# EAGLE design Nano_C1101 (EAGLE 9.5.2)
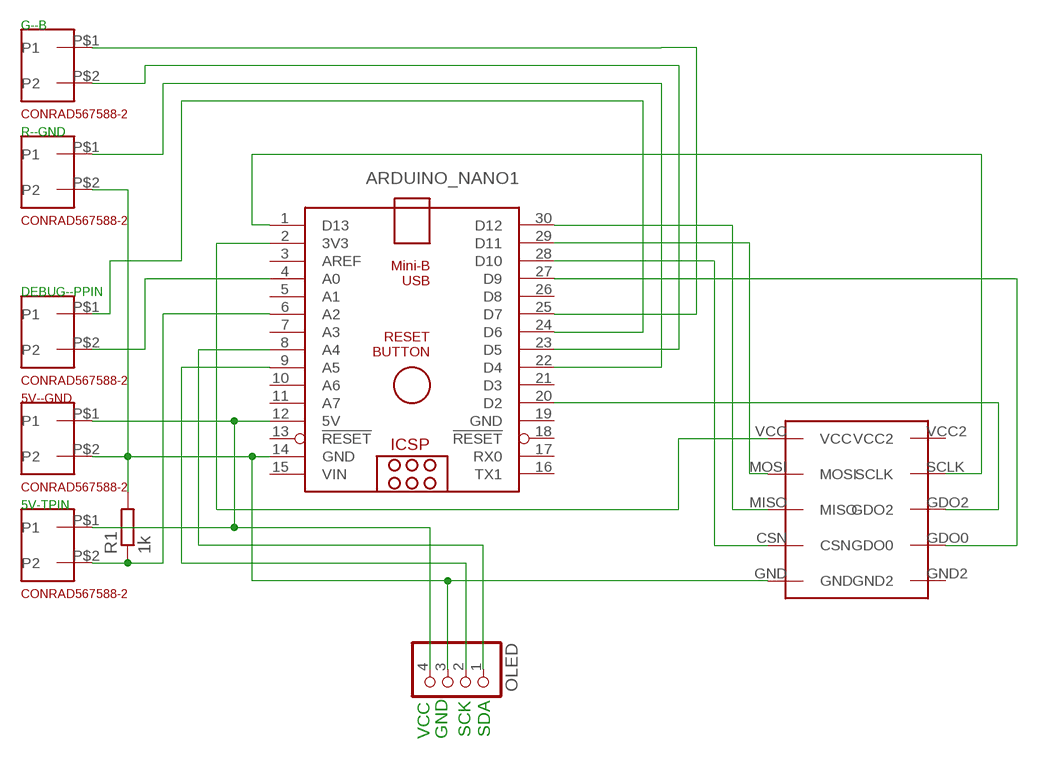
[diagram p0: schematic, sheet 1]

## Parts
5V--GND  CONRAD567588-2  [CONRAD567588]
5V-TPIN  CONRAD567588-2  [CONRAD567588]
ARDUINO_NANO1  ARDUINO_NANO  [ARDUINO_NANO]
DEBUG--PPIN  CONRAD567588-2  [CONRAD567588]
G--B  CONRAD567588-2  [CONRAD567588]
OLED  PINHD-1X4  [1X04]
R1  1k  R-EU_0204/7  [0204/7]
R--GND  CONRAD567588-2  [CONRAD567588]
U$1  NEUFTECH_CC1101  [NEUFTECH_CC1101_PACKAGE]

## Nets
3V3: ARDUINO_NANO1.2(3V3) U$1.VCC
5V: 5V--GND.P$1(P1) 5V-TPIN.P$1(P1) ARDUINO_NANO1.12(5V) OLED.4
B-RGB: ARDUINO_NANO1.23(D5) G--B.P$2(P2)
CSN: ARDUINO_NANO1.28(D10) U$1.CSN
DEBUG: ARDUINO_NANO1.24(D6) DEBUG--PPIN.P$1(P1)
G-RGB: ARDUINO_NANO1.25(D7) G--B.P$1(P1)
GDO0: ARDUINO_NANO1.27(D9) U$1.GDO0
GDO2: ARDUINO_NANO1.20(D2) U$1.GDO2
GND: 5V--GND.P$2(P2) ARDUINO_NANO1.14(GND) OLED.3 R1.2 R--GND.P$2(P2) U$1.GND
MISO: ARDUINO_NANO1.30(D12) U$1.MISO
MOSI: ARDUINO_NANO1.29(D11) U$1.MOSI
PPIN: ARDUINO_NANO1.4(A0) DEBUG--PPIN.P$2(P2)
R-RGB: ARDUINO_NANO1.22(D4) R--GND.P$1(P1)
SCK: ARDUINO_NANO1.9(A5) OLED.2
SCLK: ARDUINO_NANO1.1(D13) U$1.SCLK
SDA: ARDUINO_NANO1.8(A4) OLED.1
TPIN: 5V-TPIN.P$2(P2) ARDUINO_NANO1.6(A2) R1.1
Unconnected: ARDUINO_NANO1.3(AREF) ARDUINO_NANO1.5(A1) ARDUINO_NANO1.7(A3) ARDUINO_NANO1.10(A6) ARDUINO_NANO1.11(A7) ARDUINO_NANO1.13(!RESET) ARDUINO_NANO1.16(TX1) ARDUINO_NANO1.17(RX0) ARDUINO_NANO1.18(!RESET) ARDUINO_NANO1.21(D3) ARDUINO_NANO1.26(D8) U$1.GND2 U$1.VCC2

## Notes on the sheet
- VCC | GND | SCK | SDA

## Power pins joined to a net without a drawn wire
GND: ARDUINO_NANO1.19(GND)
VIN: ARDUINO_NANO1.15(VIN)

## Library data of the parts
5V--GND 5V-TPIN DEBUG--PPIN G--B R--GND = johannes:CONRAD567588-2
ARDUINO_NANO1 = ArduinoNanoV30:ARDUINO_NANO: Arduino Nano V3.0 Overview: The Arduino Nano is a small, complete, and breadboard-friendly board based on the ATmega328 (Arduino Nano 3.x) or ATmega168 (Arduino Nano 2.x). It has more or less the same functionality of the Arduino Duemilanove, but in a different package. It lacks only a DC power jack, and works with a Mini-B USB cable instead of a standard one. The Nano was designed and is being produced by Gravitech. Specifications: Microcontroller Atmel ATmega168 or ATmega328 Operating Voltage (logic level) 5 V Input Voltage (recommended) 7-12 V Input Voltage (limits) 6-20 V Digital I/O Pins 14 (of which 6 provide PWM output) Analog Input Pins 8 DC Current per I/O Pin 40 mA Flash Memory 16 KB (ATmega168) or 32 KB (ATmega328) of which 2 KB used by bootloader SRAM 1 KB (ATmega168) or 2 KB (ATmega328) EEPROM 512 bytes (ATmega168) or 1 KB (ATmega328) Clock Speed 16 MHz Dimensions 0.73" x 1.70" Length 45 mm Width 18 mm Weigth 5 g Power: The Arduino Nano can be powered via the Mini-B USB connection, 6-20V unregulated external power supply (pin 30), or 5V regulated external power supply (pin 27). The power source is automatically selected to the highest voltage source. Memory: The ATmega168 has 16 KB of flash memory for storing code (of which 2 KB is used for the bootloader); the ATmega328 has 32 KB, (also with 2 KB used for the bootloader). The ATmega168 has 1 KB of SRAM and 512 bytes of EEPROM (which can be read and written with the EEPROM library); the ATmega328 has 2 KB of SRAM and 1 KB of EEPROM. Input and Output: Each of the 14 digital pins on the Nano can be used as an input or output, using pinMode(), digitalWrite(), and digitalRead() functions. They operate at 5 volts. Each pin can provide or receive a maximum of 40 mA and has an internal pull-up resistor (disconnected by default) of 20-50 kOhms. In addition, some pins have specialized functions. Visit Arduino - ArduinoBoardNano <https://www.arduino.cc/en/Main/ArduinoBoardNano>
OLED = pinhead:PINHD-1X4: PIN HEADER
R1 = rcl:R-EU_: RESISTOR, European symbol; SPICEPREFIX: R
U$1 = johannes:NEUFTECH_CC1101

## Board
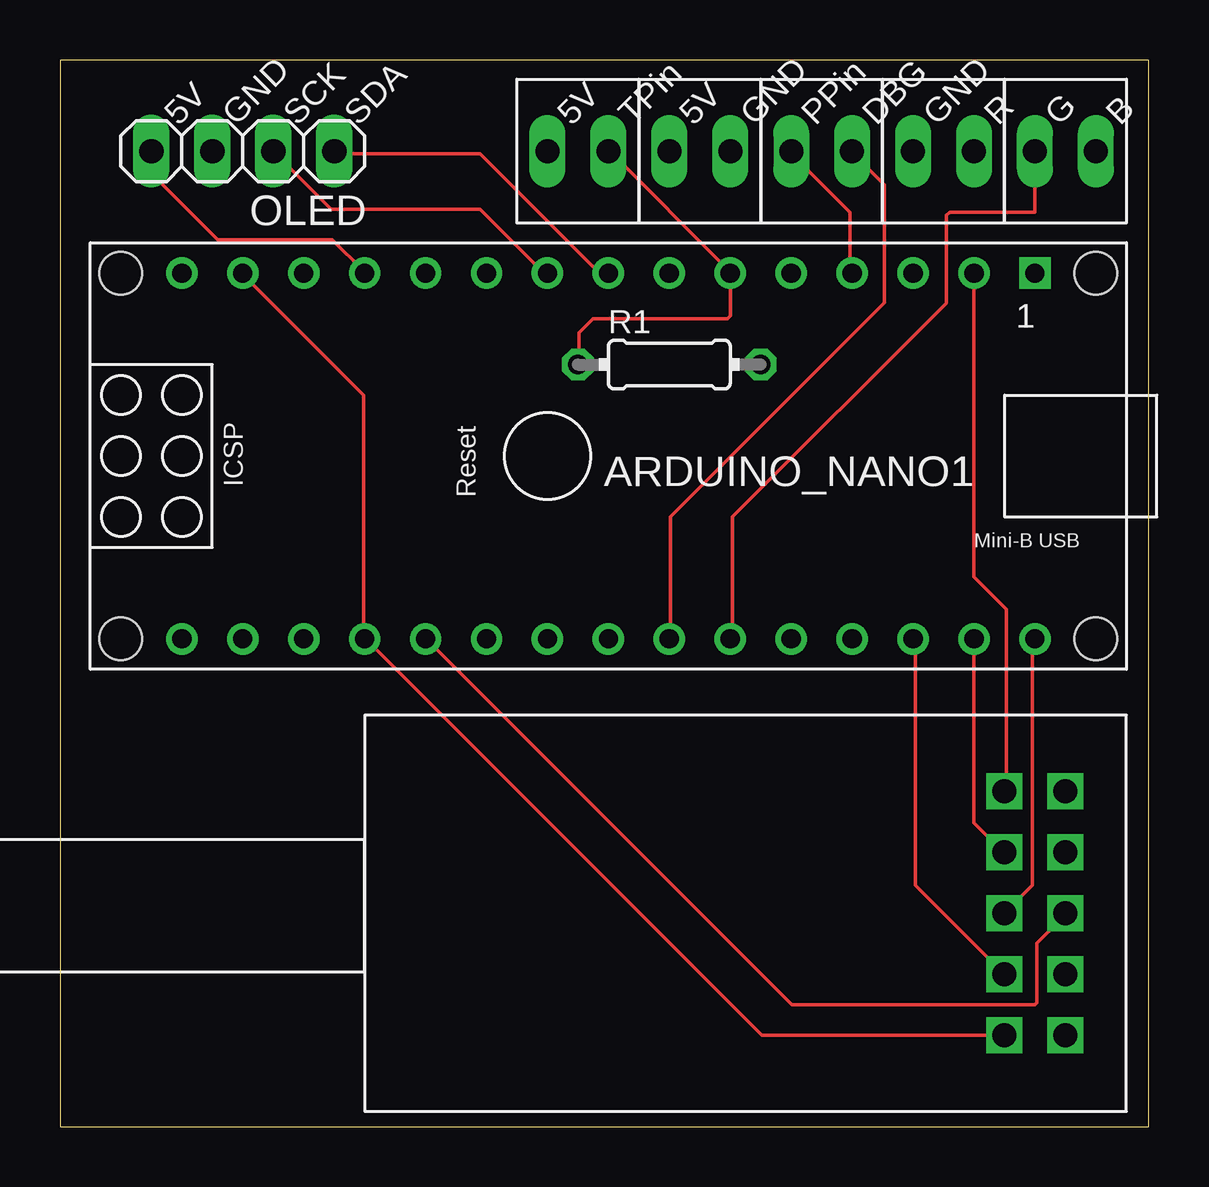
[diagram p1: board, top side]
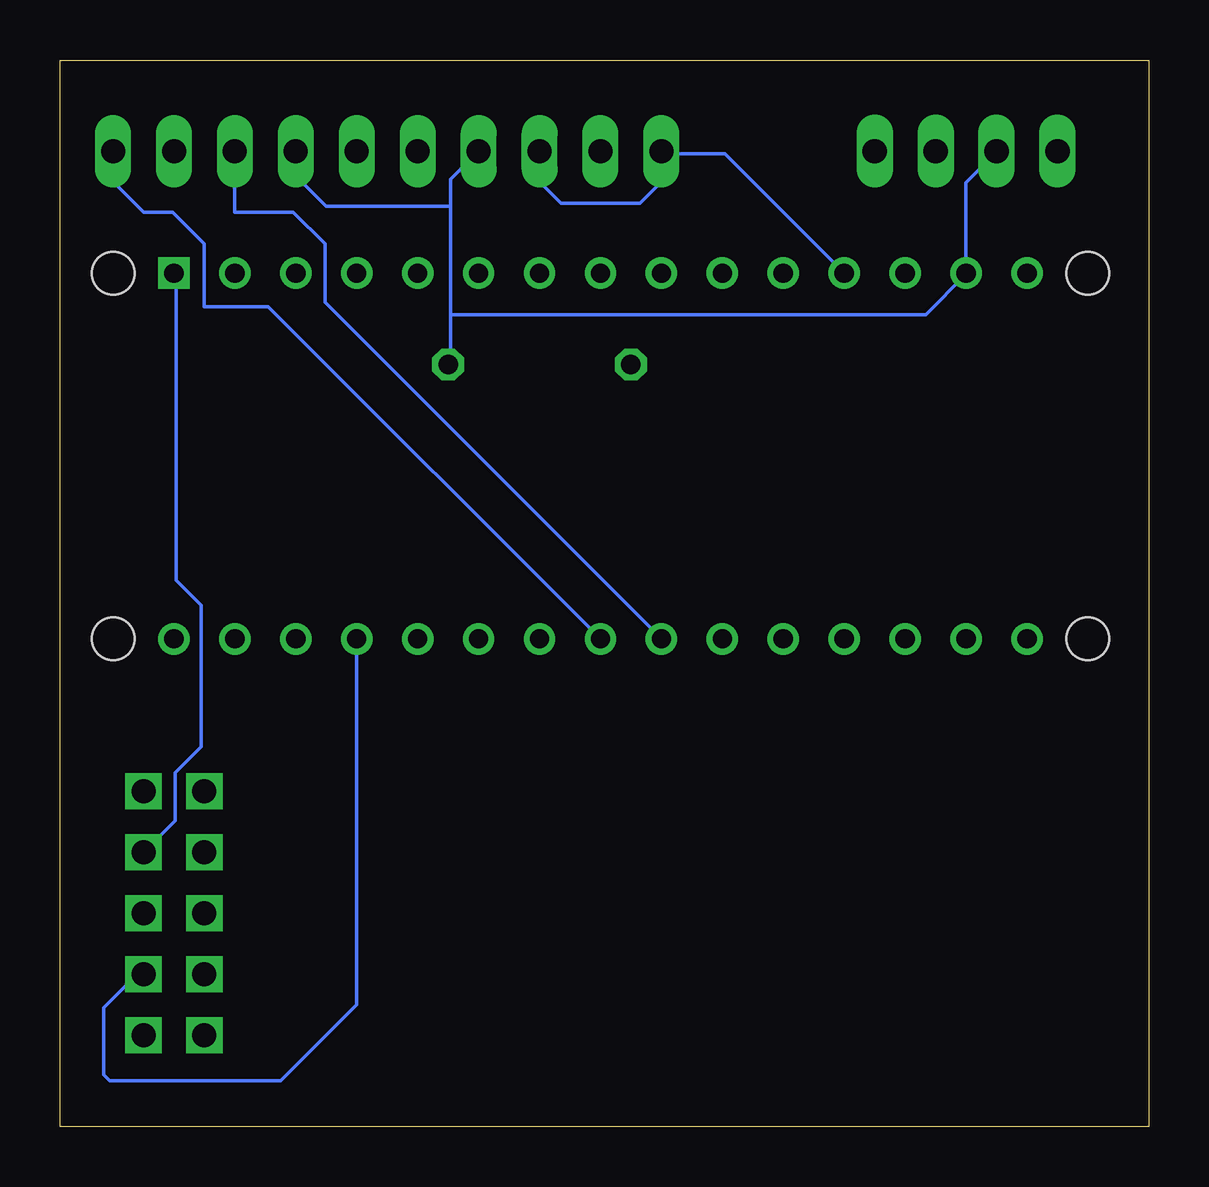
[diagram p2: board, bottom side, seen from below]

Size 45.39 x 44.44 mm. Coordinates in mm from the lower left corner, seen from the top.
Outline: 0,0 45.39,0 45.39,44.44 0,44.44 0,0
Copper layers (1*16): Top 0.035mm / dielectric 1.5mm / Bottom 0.035mm
Design rules "default": minimum track width 6mil, minimum drill 0.35mm, track to track 6mil, track to pad 6mil, pad to pad 6mil, via to via 6mil, smd to smd 6mil, copper to edge 40mil, drill to drill 6mil, minimum pad ring 10mil, minimum via ring 8mil, stop-mask expansion 4mil, vias tented up to drill 0mil, thermal gap 10mil

### Footprints (pad centres in the part's own frame; a part is rotated, then mirrored left to right if it is on the bottom)
CONRAD567588 = drill 1 long: P$1 -1.27,0; P$2 1.27,0
ARDUINO_NANO = drill 0.8 square: 1 -20.32,-7.62 | drill 0.8: 2 -17.78,-7.62; 3 -15.24,-7.62; 4 -12.7,-7.62; 5 -10.16,-7.62; 6 -7.62,-7.62; 7 -5.08,-7.62; 8 -2.54,-7.62; 9 0,-7.62; 10 2.54,-7.62; 11 5.08,-7.62; 12 7.62,-7.62; 13 10.16,-7.62; 14 12.7,-7.62; 15 15.24,-7.62; 16 15.24,7.62; 17 12.7,7.62; 18 10.16,7.62; 19 7.62,7.62; 20 5.08,7.62; 21 2.54,7.62; 22 0,7.62; 23 -2.54,7.62; 24 -5.08,7.62; 25 -7.62,7.62; 26 -10.16,7.62; 27 -12.7,7.62; 28 -15.24,7.62; 29 -17.78,7.62; 30 -20.32,7.62 | hole 1.778: -22.86,-7.62; -22.86,7.62; 17.78,7.62; 17.78,-7.62
1X04 = drill 1.016 long: 1 -3.81,0; 2 -1.27,0; 3 1.27,0; 4 3.81,0
0204/7 = drill 0.813 octagon: 1 -3.81,0; 2 3.81,0
NEUFTECH_CC1101_PACKAGE = drill 1 square: CSN 2.54,2.54; GDO0 2.54,0; GDO2 5.08,0; GND 0,2.54; GND2 0,0; MISO 5.08,2.54; MOSI 7.62,2.54; SCLK 7.62,0; VCC 10.16,2.54; VCC2 10.16,0

### Placement (x,y rotation side)
5V--GND  26.67,40.64 0 top
5V-TPIN  21.59,40.64 0 top
ARDUINO_NANO1  20.32,27.94 180 top
DEBUG--PPIN  31.75,40.64 180 top
G--B  41.91,40.64 0 top
OLED  7.62,40.64 180 top
R1  25.4,31.75 0 top
R--GND  36.83,40.64 180 top
U$1  41.91,3.81 90 top

### Tracks (layer width: path | path; a pad name or v marks a point on that pad's centre or on a via)
3V3
  Top 0.152: ARDUINO_NANO1.2 38.1,22.91 39.45,21.57 39.45,14.05 U$1.VCC
5V
  Top 0.152: OLED.4 3.81,39.73 6.58,36.96 11.35,36.96 12.65,35.66 ARDUINO_NANO1.12
  Bottom 0.152: ARDUINO_NANO1.12 17.68,40.54 20.27,40.54 5V-TPIN.P$1 20.32,39.37 21.21,38.48 24.51,38.48 25.4,39.37 5V--GND.P$1
B-RGB
  Bottom 0.152: ARDUINO_NANO1.23 36.7,34.16 39.37,34.16 39.37,36.78 40.69,38.1 41.91,38.1 43.18,39.37 G--B.P$2
CSN
  Top 0.152: U$1.CSN 35.66,10.06 35.66,20.27 ARDUINO_NANO1.28
DEBUG
  Top 0.152: ARDUINO_NANO1.24 25.45,20.42 25.45,25.4 34.37,34.31 34.37,39.24 33.07,40.54 DEBUG--PPIN.P$1
G-RGB
  Top 0.152: ARDUINO_NANO1.25 28.04,20.42 28.04,25.4 36.88,34.24 36.93,34.29 36.96,34.31 36.96,37.97 37.08,38.1 40.64,38.1 G--B.P$1
GDO0
  Bottom 0.152: ARDUINO_NANO1.27 33.02,5.08 36.2,1.91 43.31,1.91 43.56,2.16 43.56,4.95 42.16,6.35 U$1.GDO0
GDO2
  Top 0.152: ARDUINO_NANO1.20 15.24,20.27 15.32,20.27 30.5,5.08 39.37,5.08 39.98,5.08 40.64,5.08 40.72,5.16 40.72,7.64 41.91,8.84 U$1.GDO2
GND
  Top 0.152: ARDUINO_NANO1.14 7.62,35.51 12.65,30.48 12.65,20.42 ARDUINO_NANO1.19 12.8,20.27 29.26,3.81 U$1.GND
  Bottom 0.152: 29.11,38.35 29.11,39.47 5V--GND.P$2 | 29.11,38.35 29.11,33.83 | 29.11,33.83 29.11,31.85 R1.2 | R--GND.P$2 35.56,39.62 34.29,38.35 29.11,38.35 | OLED.3 6.4,40.54 7.62,39.32 ARDUINO_NANO1.14 7.62,35.51 9.3,33.83 29.11,33.83
MISO
  Top 0.152: U$1.MISO 40.54,10.06 40.54,20.27 ARDUINO_NANO1.30
MOSI
  Top 0.152: ARDUINO_NANO1.29 38.1,12.65 39.32,11.43 U$1.MOSI
PPIN
  Top 0.152: ARDUINO_NANO1.4 32.92,35.66 32.92,38.1 30.48,40.54 DEBUG--PPIN.P$2
R-RGB
  Bottom 0.152: ARDUINO_NANO1.22 34.34,34.34 34.34,36.78 35.66,38.1 38.1,38.1 R--GND.P$1
SCK
  Top 0.152: OLED.2 11.3,38.23 17.5,38.23 20.07,35.66 20.27,35.66 ARDUINO_NANO1.9
SCLK
  Bottom 0.152: U$1.SCLK 40.59,12.75 40.59,14.73 39.5,15.82 39.5,21.72 40.54,22.76 40.54,35.51 ARDUINO_NANO1.1
SDA
  Top 0.152: ARDUINO_NANO1.8 22.86,35.66 22.38,35.66 17.5,40.54 11.43,40.54 OLED.1
TPIN
  Top 0.152: 5V-TPIN.P$2 22.86,40.69 27.89,35.66 ARDUINO_NANO1.6 27.94,33.78 27.81,33.66 22.23,33.66 21.64,33.07 21.64,31.85 R1.1

### Text on the board
tNames: 5V | GND | SCK | SDA | 5V | TPin | 5V | GND | PPin | DBG | GND | R | G | B